# Altium schematic sheet CLKB_main.SchDoc
size A3
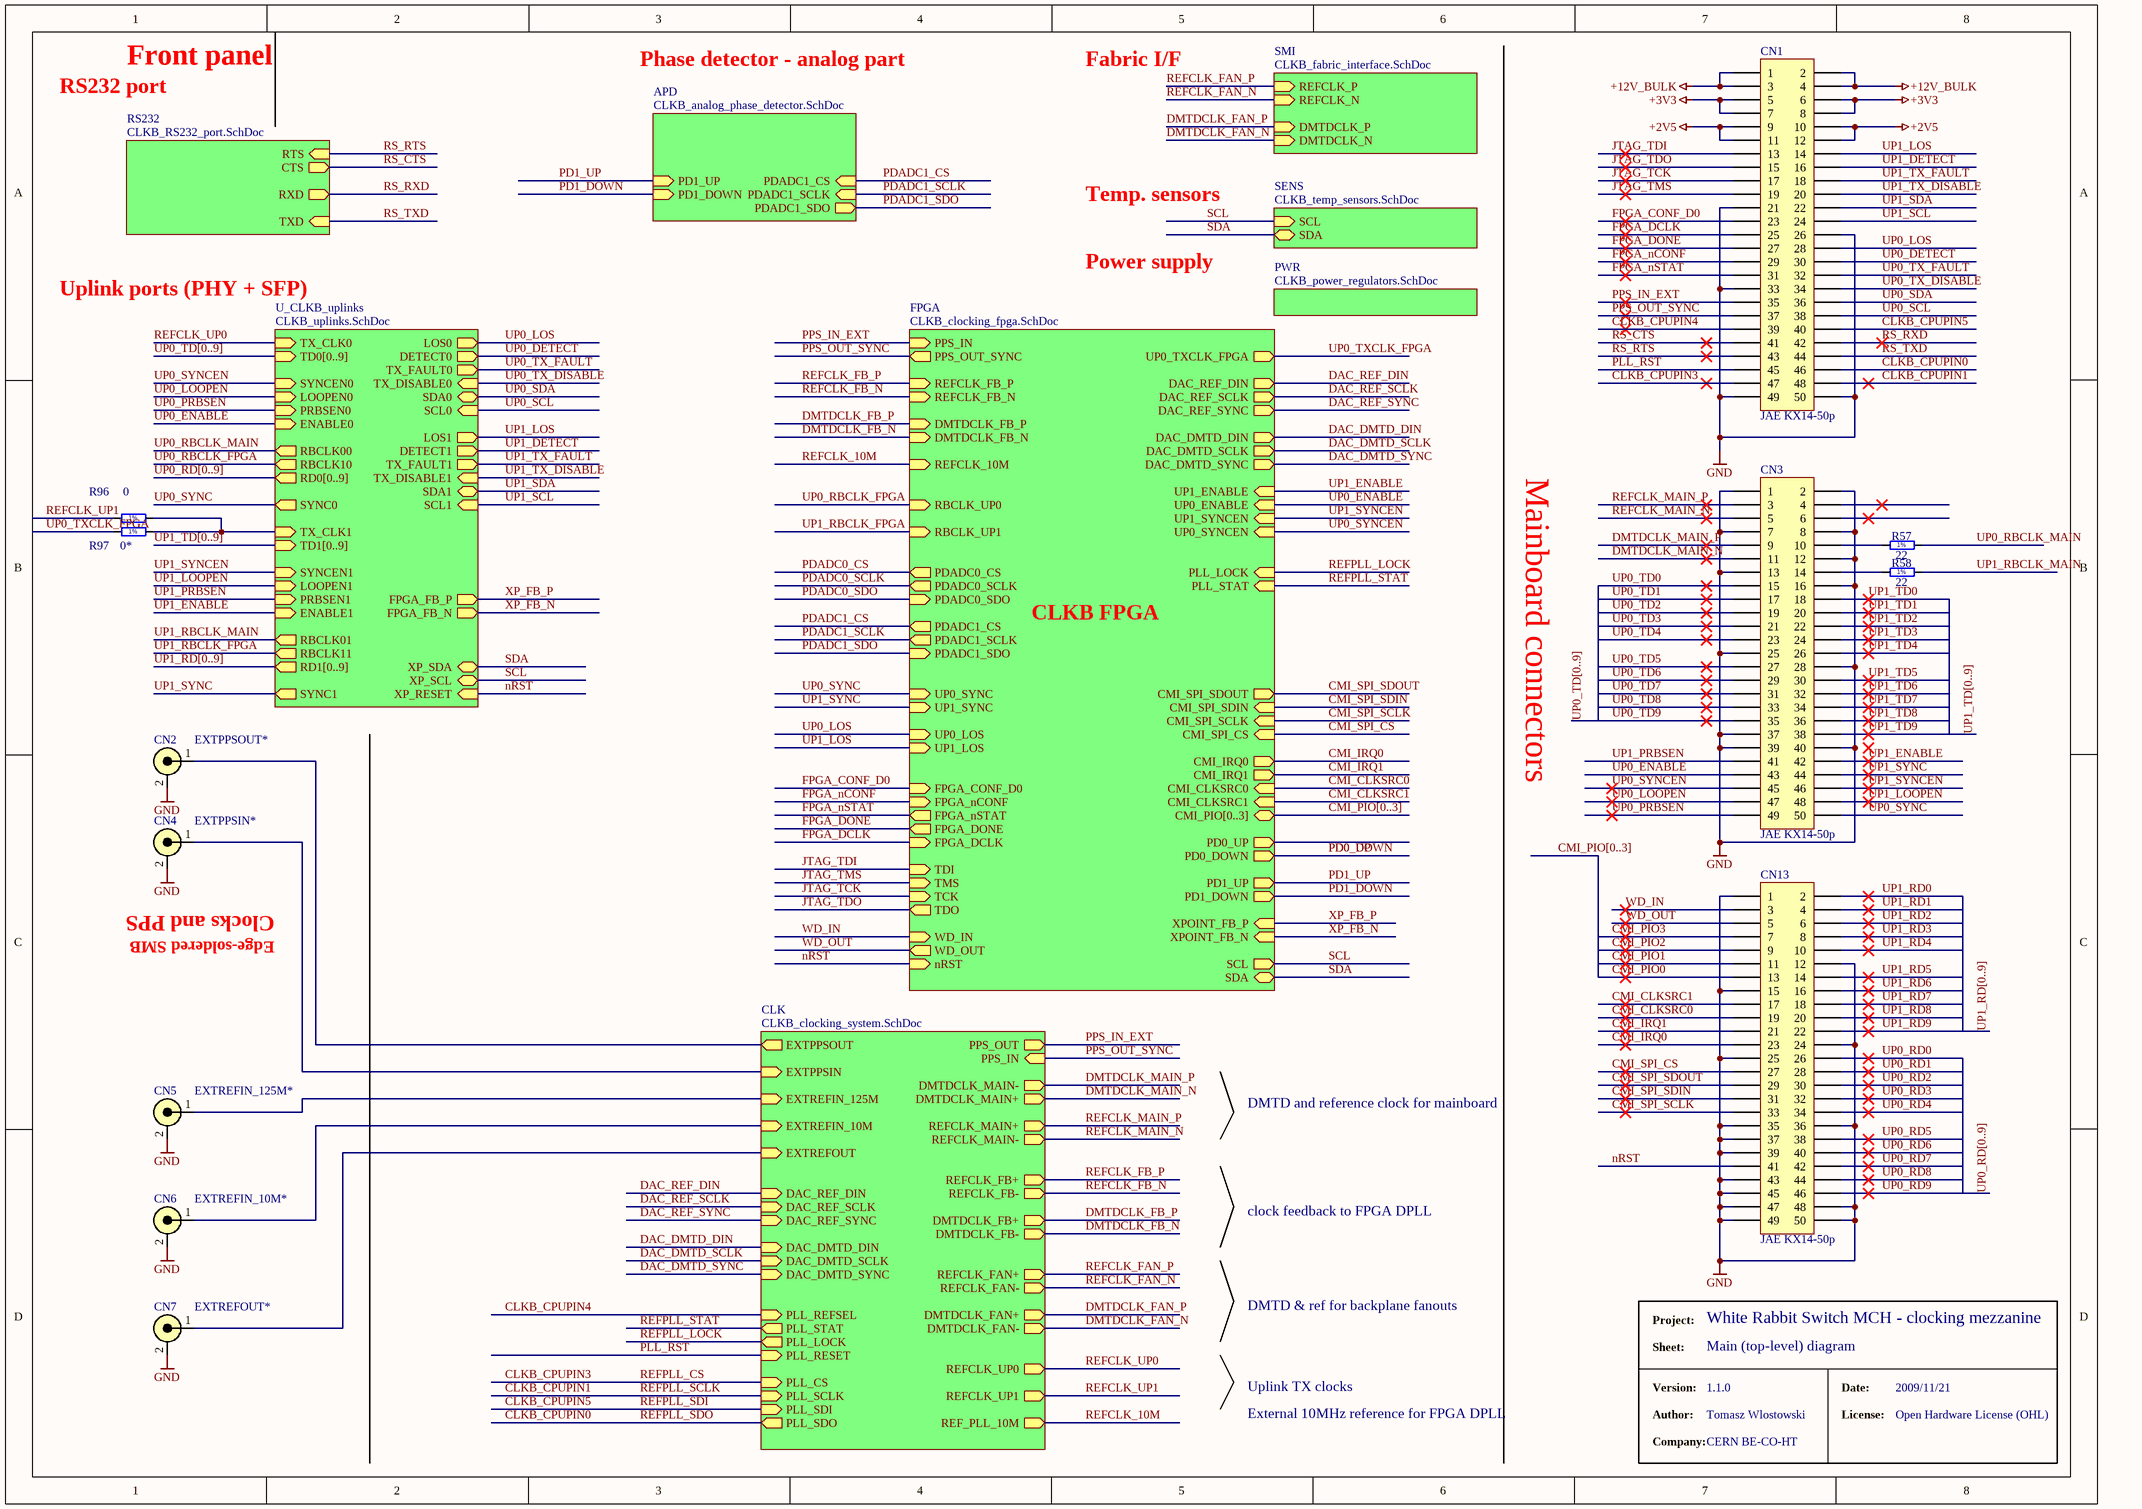
[diagram p0: CLKB_main.SchDoc]

## Parts
CN1  JAE KX14-50p  [JAE_KX14_50P]
CN2  EXTPPSOUT*  [MCH_SPECIAL_FP_CLOCKS]
CN3  JAE KX14-50p  [JAE_KX14_50P]
CN4  EXTPPSIN*  [MCH_SPECIAL_FP_CLOCKS]
CN5  EXTREFIN_125M*  [MCH_SPECIAL_FP_CLOCKS]
CN6  EXTREFIN_10M*  [MCH_SPECIAL_FP_CLOCKS]
CN7  EXTREFOUT*  [MCH_SPECIAL_FP_CLOCKS]
CN13  JAE KX14-50p  [JAE_KX14_50P]
R57  22  [RESC1608X55N]
R58  22  [RESC1608X55N]
R96  0  [RESC1005X40N]
R97  0*  [RESC1005X40N]

## Sub-sheets
APD = CLKB_analog_phase_detector.SchDoc: PDADC1_SDO (out), PDADC1_CS (in), PD1_DOWN (in), PDADC1_SCLK (in), PD1_UP (in)
CLK = CLKB_clocking_system.SchDoc: EXTREFIN_10M (in), EXTREFIN_125M (in), EXTREFOUT (in), REFCLK_MAIN+ (out), REFCLK_MAIN- (out), REFCLK_FB+ (out), REFCLK_FB- (out), DAC_DMTD_SYNC (in), DAC_DMTD_SCLK (in), DAC_DMTD_DIN (in), DAC_REF_SYNC (in), DAC_REF_SCLK (in), DAC_REF_DIN (in), DMTDCLK_MAIN+ (out), DMTDCLK_MAIN- (out), EXTPPSIN (in), PPS_IN (in), PPS_OUT (out), EXTPPSOUT (out), REFCLK_UP0 (out), DMTDCLK_FB+ (out), DMTDCLK_FB- (out), REF_PLL_10M (out), REFCLK_UP1 (out), REFCLK_FAN+ (out), REFCLK_FAN- (out), PLL_RESET (in), PLL_LOCK (out), DMTDCLK_FAN+ (out), DMTDCLK_FAN- (out), PLL_CS (in), PLL_SCLK (in), PLL_SDI (in), PLL_SDO (out), PLL_STAT (out), PLL_REFSEL (in)
FPGA = CLKB_clocking_fpga.SchDoc: TDI (in), TDO (out), TCK (in), TMS (in), RBCLK_UP0 (in), RBCLK_UP1 (in), CMI_SPI_SDIN (in), CMI_SPI_SCLK (in), UP0_LOS (in), CMI_SPI_CS (in), CMI_SPI_SDOUT (out), UP1_LOS (in), FPGA_DCLK (in), DAC_REF_SYNC (out), DAC_REF_DIN (out), DAC_REF_SCLK (out), DAC_DMTD_SYNC (out), DAC_DMTD_SCLK (out), DAC_DMTD_DIN (out), CMI_IRQ0 (out), CMI_IRQ1 (out), CMI_CLKSRC0 (in), CMI_CLKSRC1 (in), CMI_PIO[0..3] (bidir), UP0_SYNC (in), PDADC0_CS (out), PDADC0_SDO (in), PDADC0_SCLK (out), UP1_SYNC (in), FPGA_CONF_D0 (in), PDADC1_CS (out), PDADC1_SDO (in), PDADC1_SCLK (out), PD0_UP (out), PD0_DOWN (out), PD1_UP (out), PD1_DOWN (out), FPGA_DONE (out), FPGA_nCONF (in), FPGA_nSTAT (out), UP1_ENABLE (in), UP0_ENABLE (in), UP1_SYNCEN (in), UP0_SYNCEN (in), WD_IN (in), WD_OUT (out), nRST (in), PPS_IN (in), PPS_OUT_SYNC (out), REFCLK_10M (in), SCL (out), SDA (bidir), REFCLK_FB_P (in), REFCLK_FB_N (in), DMTDCLK_FB_P (in), DMTDCLK_FB_N (in), UP0_TXCLK_FPGA (out), PLL_LOCK (in), XPOINT_FB_P (in), XPOINT_FB_N (in), PLL_STAT (in)
PWR = CLKB_power_regulators.SchDoc: no entries
RS232 = CLKB_RS232_port.SchDoc: TXD (in), RXD (out), CTS (out), RTS (in)
SENS = CLKB_temp_sensors.SchDoc: SDA (bidir), SCL (in)
SMI = CLKB_fabric_interface.SchDoc: REFCLK_P (in), REFCLK_N (in), DMTDCLK_N (in), DMTDCLK_P (in)
U_CLKB_uplinks = CLKB_uplinks.SchDoc: TD0[0..9] (in), RD0[0..9] (out), TX_CLK0 (in), RBCLK00 (out), SYNCEN0 (in), LOOPEN0 (in), PRBSEN0 (in), ENABLE0 (in), SYNC0 (out), TD1[0..9] (in), TX_CLK1 (in), RBCLK10 (out), RBCLK11 (out), SYNCEN1 (in), LOOPEN1 (in), PRBSEN1 (in), ENABLE1 (in), SYNC1 (out), TX_DISABLE0 (in), TX_FAULT0 (out), LOS0 (out), DETECT0 (out), SCL0 (in), SDA0 (bidir), TX_DISABLE1 (in), TX_FAULT1 (out), LOS1 (out), DETECT1 (out), SCL1 (in), SDA1 (bidir), FPGA_FB_N (out), FPGA_FB_P (out), RBCLK01 (out), RD1[0..9] (out), XP_SDA (bidir), XP_SCL (bidir), XP_RESET (in)

## Nets
+2V5: CN1.9 CN1.10 CN1.11 CN1.12
+3V3: CN1.5 CN1.6 CN1.7 CN1.8
+12V_BULK: CN1.1 CN1.2 CN1.3 CN1.4
GND: CN1.21 CN1.26 CN1.33 CN1.49 CN1.50 CN2.2(GND) CN3.1 CN3.2 CN3.7 CN3.8 CN3.12 CN3.13 CN3.16 CN3.25 CN3.28 CN3.37 CN3.39 CN3.40 CN4.2(GND) CN5.2(GND) CN6.2(GND) CN7.2(GND) CN13.1 CN13.12 CN13.15 CN13.24 CN13.25 CN13.35 CN13.36 CN13.37 CN13.39 CN13.43 CN13.45 CN13.47 CN13.48 CN13.49 CN13.50
CLKB_CPUPIN0: CN1.46 ; sheet CLK/PLL_SDO  [also labelled REFPLL_SDO]
CLKB_CPUPIN1: CN1.48 ; sheet CLK/PLL_SCLK  [also labelled REFPLL_SCLK]
CLKB_CPUPIN3: CN1.47 ; sheet CLK/PLL_CS  [also labelled REFPLL_CS]
CLKB_CPUPIN4: CN1.39 ; sheet CLK/PLL_REFSEL
CLKB_CPUPIN5: CN1.40 ; sheet CLK/PLL_SDI  [also labelled REFPLL_SDI]
CMI_CLKSRC0: CN13.19 ; sheet FPGA/CMI_CLKSRC0
CMI_CLKSRC1: CN13.17 ; sheet FPGA/CMI_CLKSRC1
CMI_IRQ0: CN13.23 ; sheet FPGA/CMI_IRQ0
CMI_IRQ1: CN13.21 ; sheet FPGA/CMI_IRQ1
CMI_PIO0: CN13.13
CMI_PIO1: CN13.11
CMI_PIO2: CN13.9
CMI_PIO3: CN13.7
CMI_SPI_CS: CN13.27 ; sheet FPGA/CMI_SPI_CS
CMI_SPI_SCLK: CN13.33 ; sheet FPGA/CMI_SPI_SCLK
CMI_SPI_SDIN: CN13.31 ; sheet FPGA/CMI_SPI_SDIN
CMI_SPI_SDOUT: CN13.29 ; sheet FPGA/CMI_SPI_SDOUT
DAC_DMTD_DIN: sheet CLK/DAC_DMTD_DIN, sheet FPGA/DAC_DMTD_DIN
DAC_DMTD_SCLK: sheet CLK/DAC_DMTD_SCLK, sheet FPGA/DAC_DMTD_SCLK
DAC_DMTD_SYNC: sheet CLK/DAC_DMTD_SYNC, sheet FPGA/DAC_DMTD_SYNC
DAC_REF_DIN: sheet CLK/DAC_REF_DIN, sheet FPGA/DAC_REF_DIN
DAC_REF_SCLK: sheet CLK/DAC_REF_SCLK, sheet FPGA/DAC_REF_SCLK
DAC_REF_SYNC: sheet CLK/DAC_REF_SYNC, sheet FPGA/DAC_REF_SYNC
DMTDCLK_FAN_N: sheet CLK/DMTDCLK_FAN-, sheet SMI/DMTDCLK_N
DMTDCLK_FAN_P: sheet CLK/DMTDCLK_FAN+, sheet SMI/DMTDCLK_P
DMTDCLK_FB_N: sheet CLK/DMTDCLK_FB-, sheet FPGA/DMTDCLK_FB_N
DMTDCLK_FB_P: sheet CLK/DMTDCLK_FB+, sheet FPGA/DMTDCLK_FB_P
DMTDCLK_MAIN_N: CN3.11 ; sheet CLK/DMTDCLK_MAIN+
DMTDCLK_MAIN_P: CN3.9 ; sheet CLK/DMTDCLK_MAIN-
FPGA_CONF_D0: CN1.23 ; sheet FPGA/FPGA_CONF_D0
FPGA_DCLK: CN1.25 ; sheet FPGA/FPGA_DCLK
FPGA_DONE: CN1.27 ; sheet FPGA/FPGA_DONE
FPGA_nCONF: CN1.29 ; sheet FPGA/FPGA_nCONF
FPGA_nSTAT: CN1.31 ; sheet FPGA/FPGA_nSTAT
JTAG_TCK: CN1.17 ; sheet FPGA/TCK
JTAG_TDI: CN1.13 ; sheet FPGA/TDI
JTAG_TDO: CN1.15 ; sheet FPGA/TDO
JTAG_TMS: CN1.19 ; sheet FPGA/TMS
nRST: CN13.41 ; sheet FPGA/nRST, sheet U_CLKB_uplinks/XP_RESET
PD0_DOWN: sheet FPGA/PD0_DOWN  [also labelled PD0_UP]
PD1_DOWN: sheet APD/PD1_DOWN, sheet FPGA/PD1_DOWN
PD1_UP: sheet APD/PD1_UP, sheet FPGA/PD1_UP
PDADC0_CS: sheet FPGA/PDADC0_CS
PDADC0_SCLK: sheet FPGA/PDADC0_SCLK
PDADC0_SDO: sheet FPGA/PDADC0_SDO
PDADC1_CS: sheet APD/PDADC1_CS, sheet FPGA/PDADC1_CS
PDADC1_SCLK: sheet APD/PDADC1_SCLK, sheet FPGA/PDADC1_SCLK
PDADC1_SDO: sheet APD/PDADC1_SDO, sheet FPGA/PDADC1_SDO
PLL_RST: CN1.45 ; sheet CLK/PLL_RESET
PPS_IN_EXT: CN1.35 ; sheet CLK/PPS_OUT, sheet FPGA/PPS_IN
PPS_OUT_SYNC: CN1.37 ; sheet CLK/PPS_IN, sheet FPGA/PPS_OUT_SYNC
REFCLK_10M: sheet CLK/REF_PLL_10M, sheet FPGA/REFCLK_10M
REFCLK_FAN_N: sheet CLK/REFCLK_FAN-, sheet SMI/REFCLK_N
REFCLK_FAN_P: sheet CLK/REFCLK_FAN+, sheet SMI/REFCLK_P
REFCLK_FB_N: sheet CLK/REFCLK_FB-, sheet FPGA/REFCLK_FB_N
REFCLK_FB_P: sheet CLK/REFCLK_FB+, sheet FPGA/REFCLK_FB_P
REFCLK_MAIN_N: CN3.5 ; sheet CLK/REFCLK_MAIN-
REFCLK_MAIN_P: CN3.3 ; sheet CLK/REFCLK_MAIN+
REFCLK_UP0: sheet CLK/REFCLK_UP0, sheet U_CLKB_uplinks/TX_CLK0
REFCLK_UP1: R96.1 ; sheet CLK/REFCLK_UP1
REFPLL_LOCK: sheet CLK/PLL_LOCK, sheet FPGA/PLL_LOCK
REFPLL_STAT: sheet CLK/PLL_STAT, sheet FPGA/PLL_STAT
RS_CTS: CN1.41 ; sheet RS232/CTS
RS_RTS: CN1.43 ; sheet RS232/RTS
RS_RXD: CN1.42 ; sheet RS232/RXD
RS_TXD: CN1.44 ; sheet RS232/TXD
SCL: sheet FPGA/SCL, sheet SENS/SCL, sheet U_CLKB_uplinks/XP_SCL
SDA: sheet FPGA/SDA, sheet SENS/SDA, sheet U_CLKB_uplinks/XP_SDA
UP0_DETECT: CN1.30 ; sheet U_CLKB_uplinks/DETECT0
UP0_ENABLE: CN3.43 ; sheet FPGA/UP0_ENABLE, sheet U_CLKB_uplinks/ENABLE0
UP0_LOOPEN: CN3.47 ; sheet U_CLKB_uplinks/LOOPEN0
UP0_LOS: CN1.28 ; sheet FPGA/UP0_LOS, sheet U_CLKB_uplinks/LOS0
UP0_PRBSEN: CN3.49 ; sheet U_CLKB_uplinks/PRBSEN0
UP0_RBCLK_FPGA: sheet FPGA/RBCLK_UP0, sheet U_CLKB_uplinks/RBCLK10
UP0_RBCLK_MAIN: R57.2 ; sheet U_CLKB_uplinks/RBCLK00
UP0_RD0: CN13.26
UP0_RD1: CN13.28
UP0_RD2: CN13.30
UP0_RD3: CN13.32
UP0_RD4: CN13.34
UP0_RD5: CN13.38
UP0_RD6: CN13.40
UP0_RD7: CN13.42
UP0_RD8: CN13.44
UP0_RD9: CN13.46
UP0_SCL: CN1.38 ; sheet U_CLKB_uplinks/SCL0
UP0_SDA: CN1.36 ; sheet U_CLKB_uplinks/SDA0
UP0_SYNC: CN3.50 ; sheet FPGA/UP0_SYNC, sheet U_CLKB_uplinks/SYNC0
UP0_SYNCEN: CN3.45 ; sheet FPGA/UP0_SYNCEN, sheet U_CLKB_uplinks/SYNCEN0
UP0_TD0: CN3.15
UP0_TD1: CN3.17
UP0_TD2: CN3.19
UP0_TD3: CN3.21
UP0_TD4: CN3.23
UP0_TD5: CN3.27
UP0_TD6: CN3.29
UP0_TD7: CN3.31
UP0_TD8: CN3.33
UP0_TD9: CN3.35
UP0_TX_DISABLE: CN1.34 ; sheet U_CLKB_uplinks/TX_DISABLE0
UP0_TX_FAULT: CN1.32 ; sheet U_CLKB_uplinks/TX_FAULT0
UP0_TXCLK_FPGA: R97.1 ; sheet FPGA/UP0_TXCLK_FPGA
UP1_DETECT: CN1.16 ; sheet U_CLKB_uplinks/DETECT1
UP1_ENABLE: CN3.42 ; sheet FPGA/UP1_ENABLE, sheet U_CLKB_uplinks/ENABLE1
UP1_LOOPEN: CN3.48 ; sheet U_CLKB_uplinks/LOOPEN1
UP1_LOS: CN1.14 ; sheet FPGA/UP1_LOS, sheet U_CLKB_uplinks/LOS1
UP1_PRBSEN: CN3.41 ; sheet U_CLKB_uplinks/PRBSEN1
UP1_RBCLK_FPGA: sheet FPGA/RBCLK_UP1, sheet U_CLKB_uplinks/RBCLK11
UP1_RBCLK_MAIN: R58.2 ; sheet U_CLKB_uplinks/RBCLK01
UP1_RD0: CN13.2
UP1_RD1: CN13.4
UP1_RD2: CN13.6
UP1_RD3: CN13.8
UP1_RD4: CN13.10
UP1_RD5: CN13.14
UP1_RD6: CN13.16
UP1_RD7: CN13.18
UP1_RD8: CN13.20
UP1_RD9: CN13.22
UP1_SCL: CN1.24 ; sheet U_CLKB_uplinks/SCL1
UP1_SDA: CN1.22 ; sheet U_CLKB_uplinks/SDA1
UP1_SYNC: CN3.44 ; sheet FPGA/UP1_SYNC, sheet U_CLKB_uplinks/SYNC1
UP1_SYNCEN: CN3.46 ; sheet FPGA/UP1_SYNCEN, sheet U_CLKB_uplinks/SYNCEN1
UP1_TD0: CN3.18
UP1_TD1: CN3.20
UP1_TD2: CN3.22
UP1_TD3: CN3.24
UP1_TD4: CN3.26
UP1_TD5: CN3.30
UP1_TD6: CN3.32
UP1_TD7: CN3.34
UP1_TD8: CN3.36
UP1_TD9: CN3.38
UP1_TX_DISABLE: CN1.20 ; sheet U_CLKB_uplinks/TX_DISABLE1
UP1_TX_FAULT: CN1.18 ; sheet U_CLKB_uplinks/TX_FAULT1
WD_IN: CN13.3 ; sheet FPGA/WD_IN
WD_OUT: CN13.5 ; sheet FPGA/WD_OUT
XP_FB_N: sheet FPGA/XPOINT_FB_N, sheet U_CLKB_uplinks/FPGA_FB_N
XP_FB_P: sheet FPGA/XPOINT_FB_P, sheet U_CLKB_uplinks/FPGA_FB_P
NetCN2_1: CN2.1(HOT) ; sheet CLK/EXTPPSOUT
NetCN3_10: CN3.10 R57.1
NetCN3_14: CN3.14 R58.1
NetCN4_1: CN4.1(HOT) ; sheet CLK/EXTPPSIN
NetCN5_1: CN5.1(HOT) ; sheet CLK/EXTREFIN_125M
NetCN6_1: CN6.1(HOT) ; sheet CLK/EXTREFIN_10M
NetCN7_1: CN7.1(HOT) ; sheet CLK/EXTREFOUT
NetR96_2: R96.2 R97.2 ; sheet U_CLKB_uplinks/TX_CLK1

Not connected (* = marked no-connect by the designer): CN3 4* 6*

## Buses and harness runs
bus CMI_PIO[0..3]
bus CMI_PIO[0..3] = sheet FPGA/CMI_PIO[0..3]
bus UP0_RD[0..9]
bus UP0_RD[0..9] = sheet U_CLKB_uplinks/RD0[0..9]
bus UP0_TD[0..9]
bus UP0_TD[0..9] = sheet U_CLKB_uplinks/TD0[0..9]
bus UP1_RD[0..9]
bus UP1_RD[0..9] = sheet U_CLKB_uplinks/RD1[0..9]
bus UP1_TD[0..9]
bus UP1_TD[0..9] = sheet U_CLKB_uplinks/TD1[0..9]

## Notes on the sheet
- RS232 port
- Front panel
- Phase detector - analog part
- Fabric I/F
- Temp. sensors
- Uplink ports (PHY + SFP)
- Power supply
- Mainboard connectors
- CLKB FPGA
- Clocks and PPS
- Edge-soldered SMB
- DMTD and reference clock for mainboard
- clock feedback to FPGA DPLL
- DMTD & ref for backplane fanouts
- Project:
- White Rabbit Switch MCH - clocking mezzanine
- Uplink TX clocks
- Sheet:
- Version:
- Main (top-level) diagram
- 1.1.0
- Date:
- 2009/11/21
- External 10MHz reference for FPGA DPLL
- Author:
- Company:
- Tomasz Wlostowski
- CERN BE-CO-HT
- License:
- Open Hardware License (OHL)
- (in symbol R0402_0R_JUMPER) 1%
- (in symbol R0603_22R_1%_0.1W_100PPM) 1%

## Library data of the parts
CN1 CN3 CN13 = KX14_50p: multipin B2B connector (plug); Supplier: Farnell
CN2 CN4-CN7 = SMA_SOCKET: SMB piggyboard connection
R57 R58 = R0603_22R_1%_0.1W_100PPM: Resistor - 1%; Part Description: General Purpose Thick Film Chip Resistor; Manufacturer: GENERIC; Manufacturer1 Part Number: NRC06F22R0TRF; Manufacturer1 Datasheet: \\cern.ch\dfs\Applications\Altium\Datasheets\R0603_NIC_NRC.pdf; Power: 0.1W; TC: ±100ppm/°C; Table: Resistors SMD; Part Number: R0603_22R_1%_0.1W_100PPM; Component Kind: Standard; Component Type: Standard; Designator: Resistor - 1%; Library Reference: Resistor - 1%; Pin Count: 2; Value: 22; Status: Preferred; Tolerance: ±1%; Manufacturer Part Number: R0603_22R_1%_0.1W_100PPM; Case: 0603; Mounted: Yes; Socket: No; SMD: Yes; Manufacturer1 Example: NIC COMPONENT; Manufacturer1 ComponentHeight: 0.55mm; HelpURL: \\cern.ch\dfs\Applications\Altium\Datasheets\R0603_NIC_NRC.pdf; Author: CERN DEM JLC; CreateDate: 12/3/2007; LatestRevisionDate: 3/13/2008
R96 = R0402_0R_JUMPER: Resistor - 1%; Part Description: 1A (0.05R Max DC Resistance) Zero Ohm Jumper; Manufacturer: GENERIC; Manufacturer1 Part Number: 232270591001; Manufacturer1 Datasheet: \\cern.ch\dfs\Applications\Altium\Datasheets\R0402_Phycomp_RC0402.pdf; Table: Resistors SMD; Part Number: R0402_0R_JUMPER; Component Kind: Standard; Component Type: Standard; Designator: Resistor - 1%; Library Reference: Resistor - 1%; Pin Count: 2; Value: 0; Status: Not recommended; Manufacturer Part Number: R0402_0R_JUMPER; Case: 0402; Mounted: Yes; Socket: No; SMD: Yes; Manufacturer1 Example: PHYCOMP; Manufacturer1 ComponentHeight: 0.4mm; HelpURL: \\cern.ch\dfs\Applications\Altium\Datasheets\R0402_Phycomp_RC0402.pdf; Author: CERN DEM JLC; CreateDate: 2007-12-03; LatestRevisionDate: 2008-03-13
R97 = R0402_0R_JUMPER: Resistor - 1%; Part Description: 1A (0.05R Max DC Resistance) Zero Ohm Jumper; Manufacturer: GENERIC; Manufacturer1 Part Number: 232270591001; Manufacturer1 Datasheet: \\cern.ch\dfs\Applications\Altium\Datasheets\R0402_Phycomp_RC0402.pdf; Value: 0; Table: Resistors SMD; Part Number: R0402_0R_JUMPER; Component Kind: Standard; Component Type: Standard; Designator: Resistor - 1%; Library Reference: Resistor - 1%; Pin Count: 2; Status: Not recommended; Manufacturer Part Number: R0402_0R_JUMPER; Case: 0402; Mounted: Yes; Socket: No; SMD: Yes; Manufacturer1 Example: PHYCOMP; Manufacturer1 ComponentHeight: 0.4mm; HelpURL: \\cern.ch\dfs\Applications\Altium\Datasheets\R0402_Phycomp_RC0402.pdf; Author: CERN DEM JLC; CreateDate: 2007-12-03; LatestRevisionDate: 2008-03-13